# EAGLE design pca9306_9dof (EAGLE 6.2)
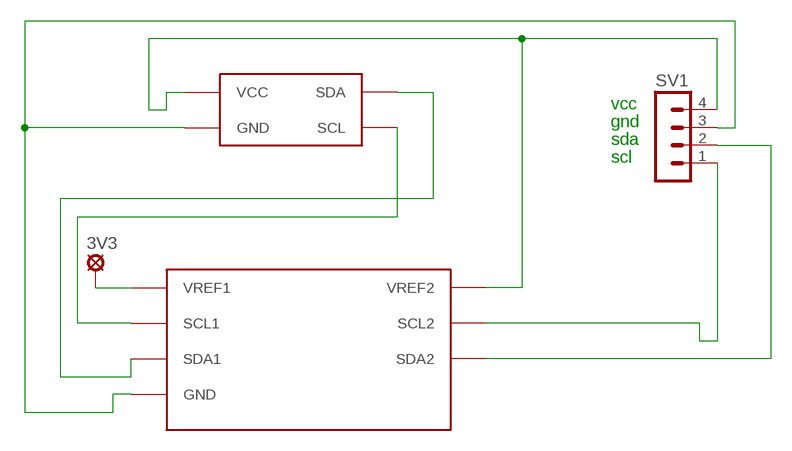
[diagram p0: schematic, sheet 1]

## Parts
3V3  LSP11  [LSP11]
SV1  MA04-1  [MA04-1]
U$1  PCA9306  [PCA9306]
U$2  9DOF  [9DOF]

## Nets
N$1: SV1.3 U$1.GND U$2.GND
N$2: SV1.4 U$1.VREF2 U$2.VCC
N$3: SV1.2 U$1.SDA2
N$4: SV1.1 U$1.SCL2
N$5: U$1.SDA1 U$2.SDA
N$6: U$1.SCL1 U$2.SCL
N$7: 3V3.MP U$1.VREF1

## Notes on the sheet
- vcc
- gnd
- sda
- scl

## Library data of the parts
3V3 = solpad:LSP11: SOLDER PAD drill 1.1 mm
SV1 = con-lstb:MA04-1: PIN HEADER; OC_FARNELL: unknown; OC_NEWARK: unknown
U$1 = SparkFun-Boards:PCA9306
U$2 = SparkFun-Boards:9DOF

## Board
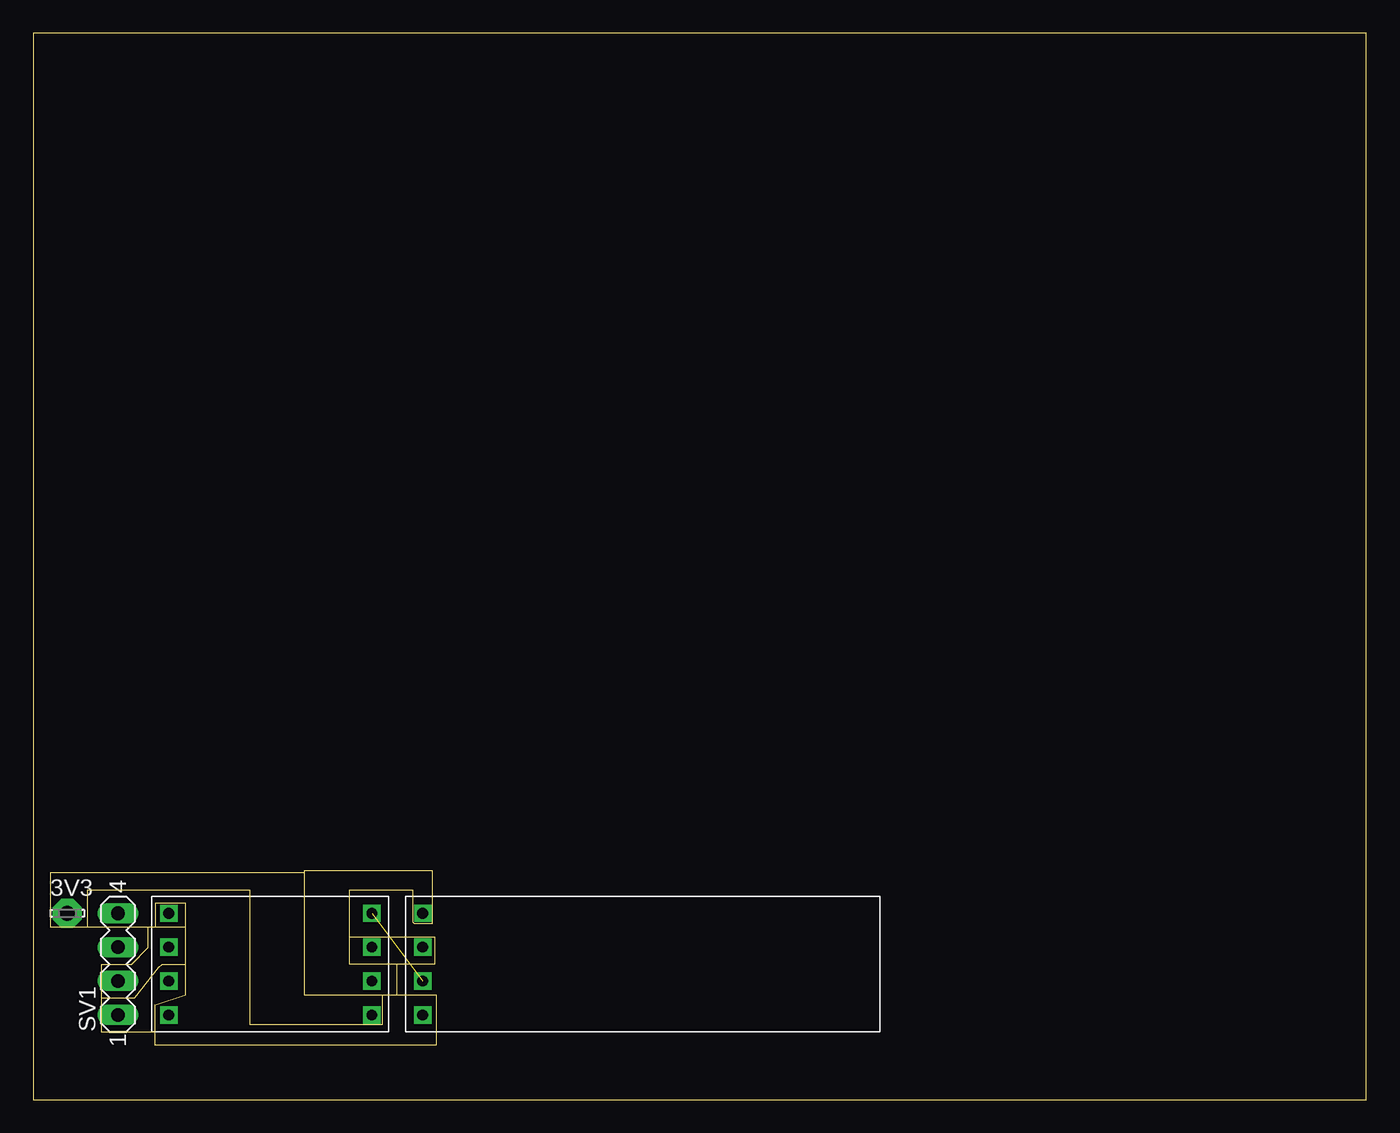
[diagram p1: board, top side]
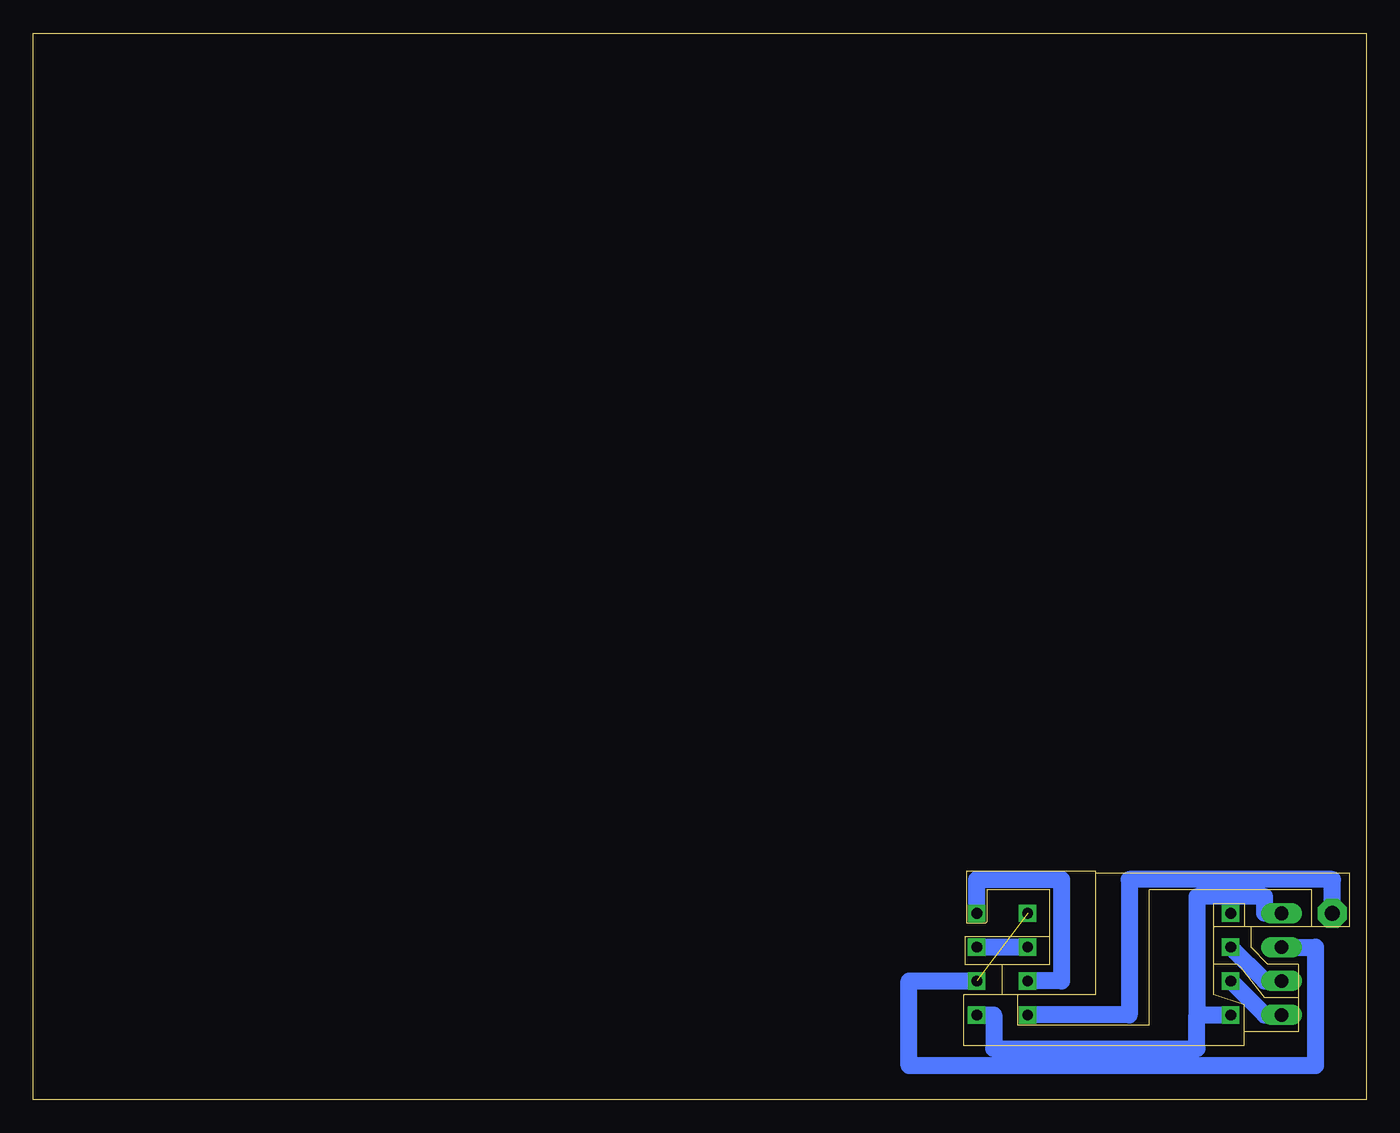
[diagram p2: board, bottom side, seen from below]

Size 100 x 80 mm. Coordinates in mm from the lower left corner, seen from the top.
Outline: 0,0 100,0 100,80 0,80 0,0
Copper layers (1*16): Top 0.035mm / dielectric 1.5mm / Bottom 0.035mm
Design rules: minimum track width 10mil, minimum drill 24mil, track to track 8mil, track to pad 8mil, pad to pad 8mil, via to via 8mil, smd to smd 8mil, copper to edge 40mil, drill to drill 8mil, minimum pad ring 10mil, minimum via ring 8mil, stop-mask expansion 4mil, vias tented up to drill 0mil, thermal gap 10mil
Milling: 48 lines

### Footprints (pad centres in the part's own frame; a part is rotated, then mirrored left to right if it is on the bottom)
LSP11 = drill 1.118 pad 2.159 octagon: MP 0,0
MA04-1 = drill 1.016 long: 1 -3.81,0; 2 -1.27,0; 3 1.27,0; 4 3.81,0
PCA9306 = drill 0.8 square: GND -7.62,-3.81; NC 7.62,-3.81; SCL1 -7.62,1.27; SCL2 7.62,1.27; SDA1 -7.62,-1.27; SDA2 7.62,-1.27; VREF1 -7.62,3.81; VREF2 7.62,3.81
9DOF = drill 0.8 square: GND 12.7,1.27; SCL 12.7,-3.81; SDA 12.7,-1.27; VCC 12.7,3.81

### Placement (x,y rotation side)
3V3  2.54,13.97 0 top
SV1  6.35,10.16 90 top
U$1  17.78,10.16 180 top
U$2  41.91,10.16 180 top

### Tracks (layer width: path | path; a pad name or v marks a point on that pad's centre or on a via)
N$1  (1 unrouted)
  Bottom 1.27: SV1.3 3.81,11.43 3.81,2.54 34.29,2.54 34.29,8.89 U$2.GND
N$2
  Bottom 1.27: SV1.4 7.62,13.97 7.62,15.24 12.7,15.24 12.7,6.35 | 12.7,6.35 U$1.VREF2 | U$2.VCC 27.94,6.35 27.94,3.81 12.7,3.81 12.7,6.35
N$3
  Bottom 1.27: SV1.2 7.62,8.89 U$1.SDA2
N$4
  Bottom 1.27: U$1.SCL2 7.62,6.35 SV1.1
N$5
  Bottom 1.27: U$1.SDA1 U$2.SDA
N$6
  Bottom 1.27: U$2.SCL 29.21,16.51 22.86,16.51 22.86,8.89 U$1.SCL1
N$7
  Bottom 1.27: 3V3.MP 2.54,16.51 17.78,16.51 17.78,6.35 U$1.VREF1